# Altium schematic sheet O.schdoc
size 492 x 302 mm
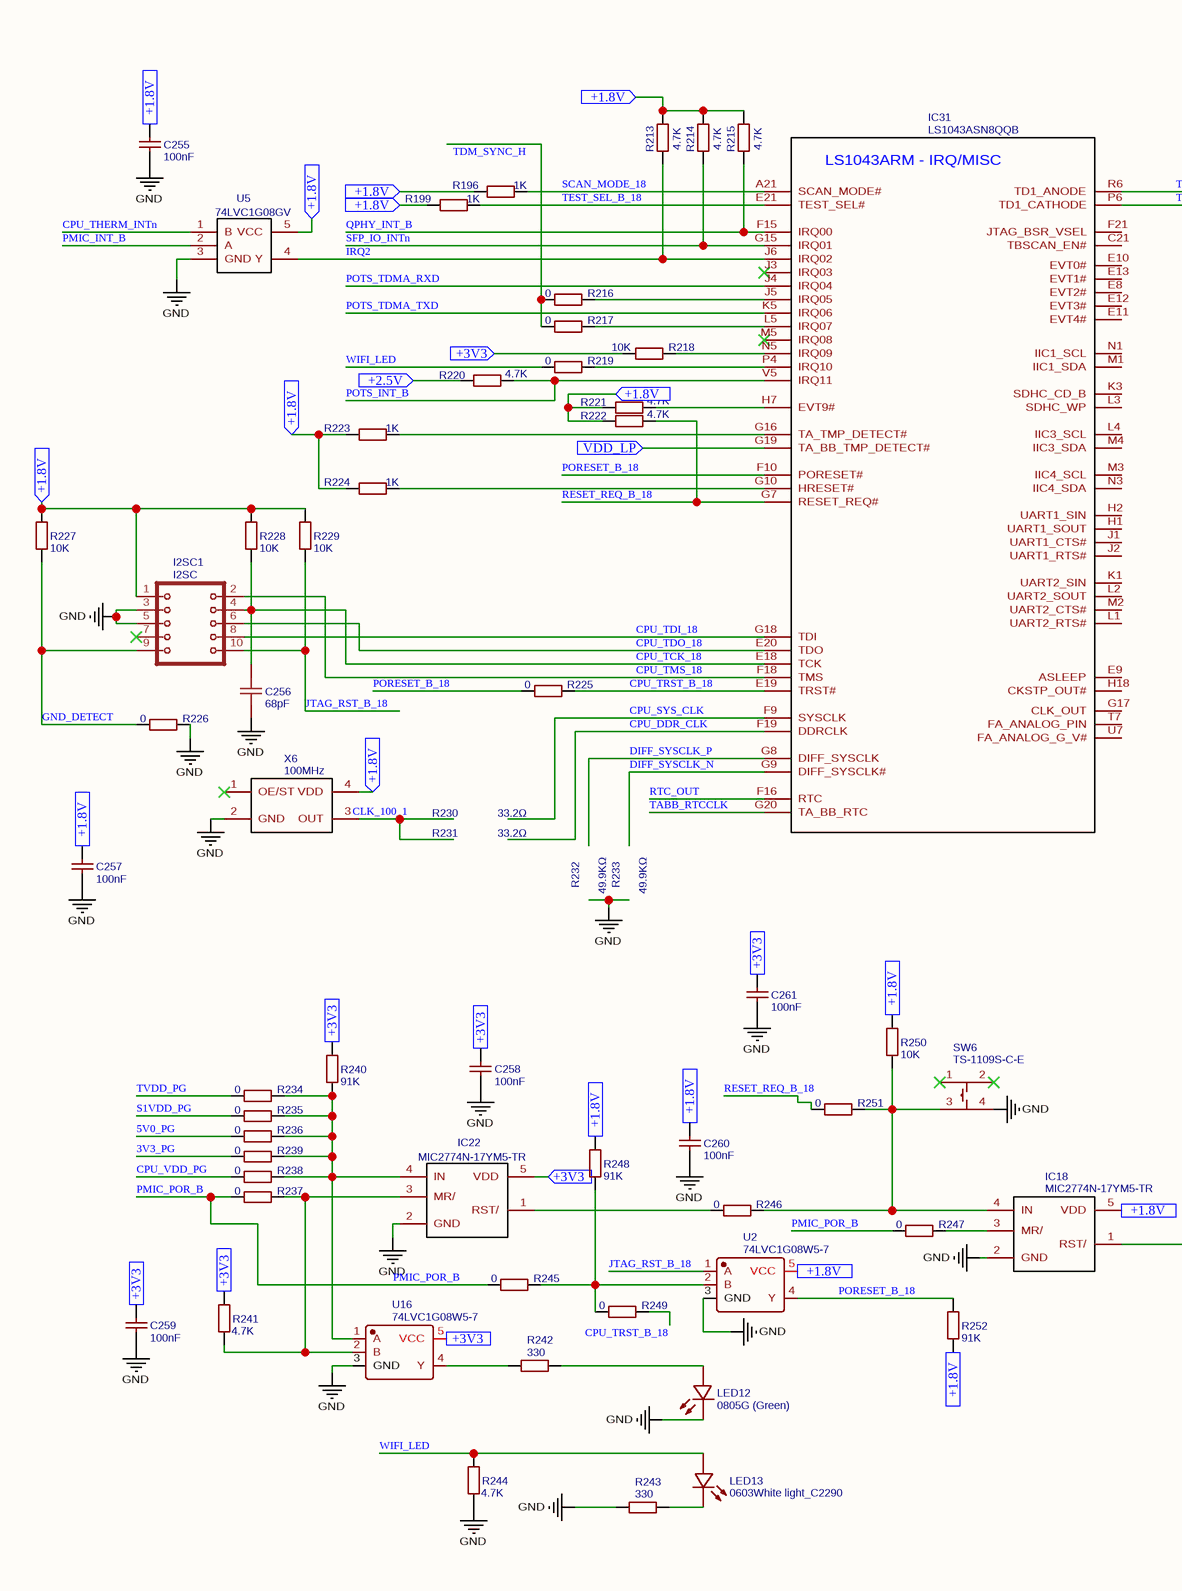
[diagram p0: O.schdoc, left]
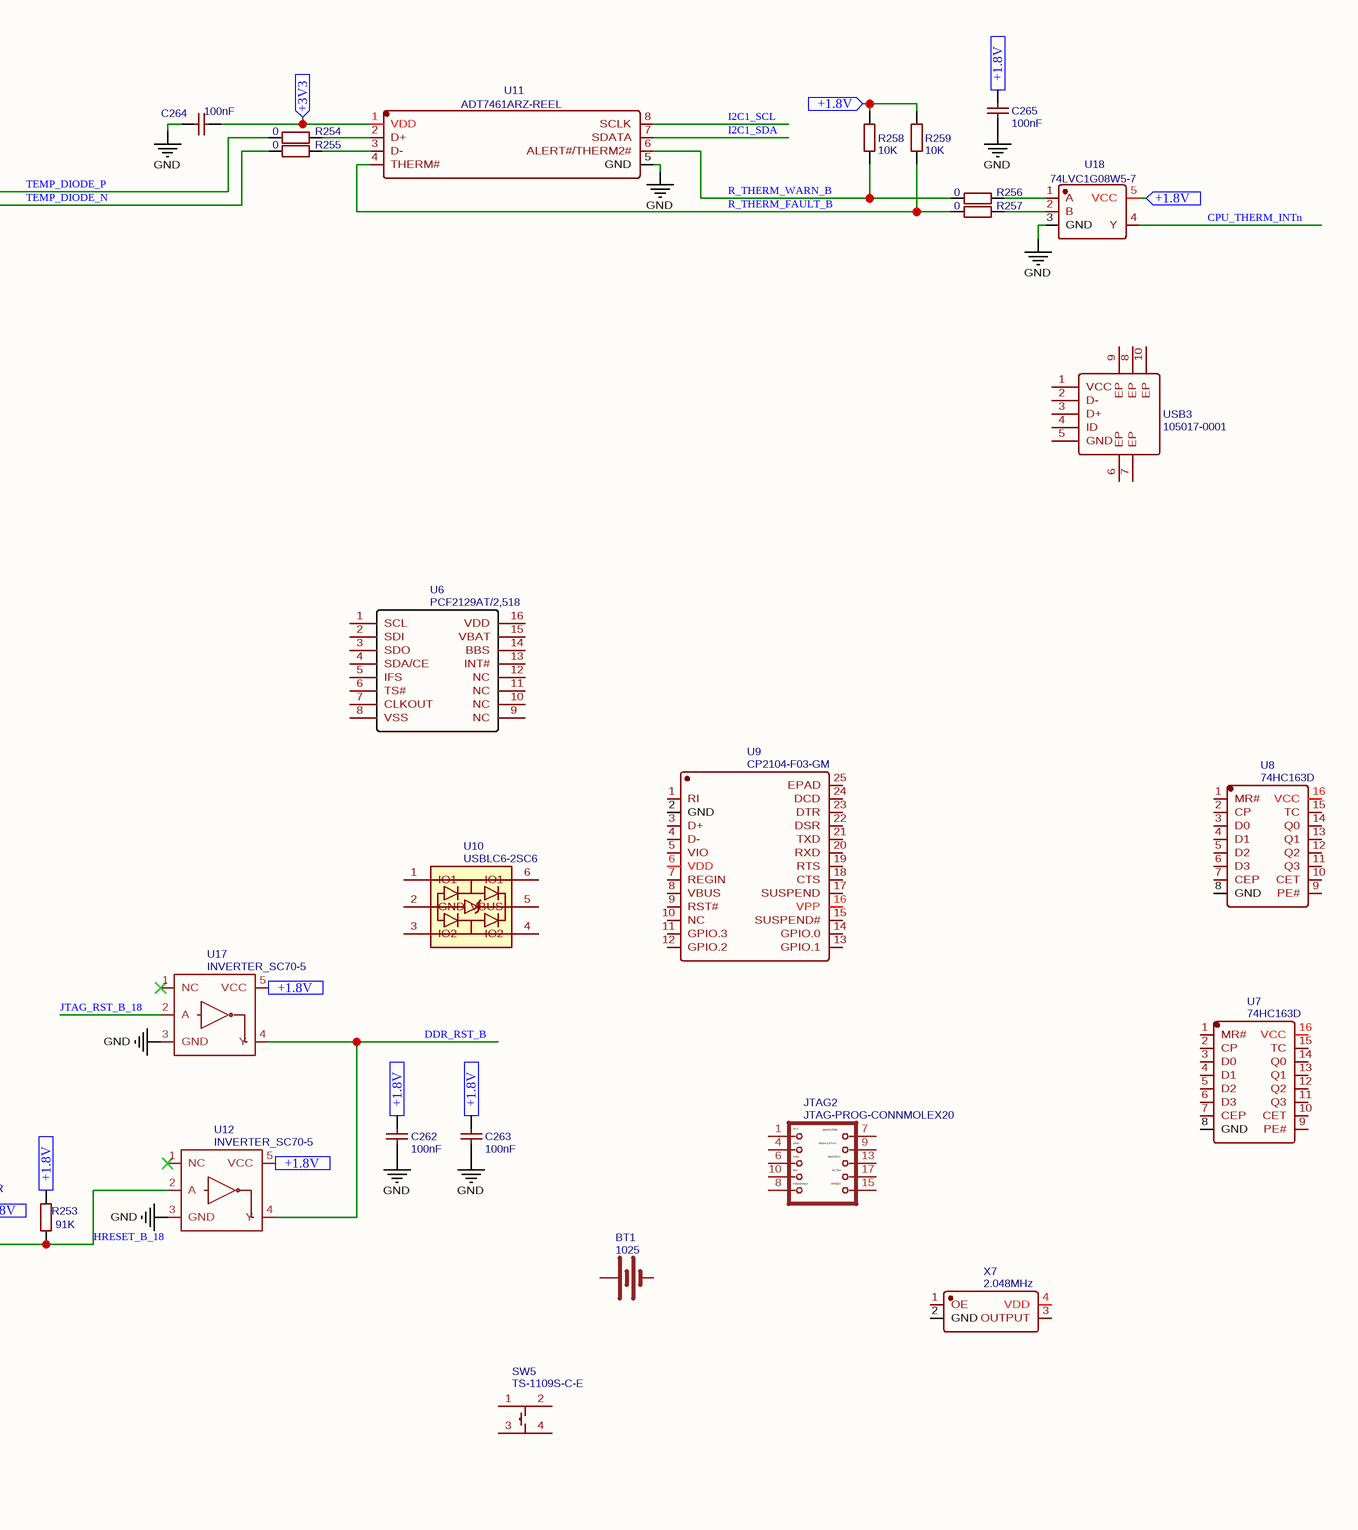
[diagram p1: O.schdoc, right]

## Parts
BT1  1025  [BAT-TH_KEYSTONE-1025]
C255  100nF  [C0402]
C256  68pF  [C0402]
C257  100nF  [C0402]
C258  100nF  [C0402]
C259  100nF  [C0402]
C260  100nF  [C0402]
C261  100nF  [C0402]
C262  100nF  [C0402]
C263  100nF  [C0402]
C264  100nF  [C0402]
C265  100nF  [C0402]
I2SC1  I2SC  [JTAG-10PIN-2.54MM-PTH]
IC18  MIC2774N-17YM5-TR  [SOT95P280X100-5N]
IC22  MIC2774N-17YM5-TR  [SOT95P280X100-5N]
IC31  LS1043ASN8QQB  [BGA621C65P25X25_1700X1700X218N]
JTAG2  JTAG-PROG-CONNMOLEX20  [JTAG-20PIN-2.54MM-PTH]
LED12  0805G (Green)  [LED0805-RD]
LED13  0603White light_C2290  [LED0603-R-RD]
R196  1K  [R0402]
R199  1K  [R0402]
R213  4.7K  [R0402]
R214  4.7K  [R0402]
R215  4.7K  [R0402]
R216  0  [R0402]
R217  0  [R0402]
R218  10K  [R0402]
R219  0  [R0402]
R220  4.7K  [R0402]
R221  4.7K  [R0402]
R222  4.7K  [R0402]
R223  1K  [R0402]
R224  1K  [R0402]
R225  0  [R0402]
R226  0  [R0402]
R227  10K  [R0402]
R228  10K  [R0402]
R229  10K  [R0402]
R230  33.2Ω  [0402]
R231  33.2Ω  [0402]
R232  49.9KΩ  [0402]
R233  49.9KΩ  [0402]
R234  0  [R0402]
R235  0  [R0402]
R236  0  [R0402]
R237  0  [R0402]
R238  0  [R0402]
R239  0  [R0402]
R240  91K  [R0402]
R241  4.7K  [R0402]
R242  330  [R0402]
R243  330  [R0402]
R244  4.7K  [R0402]
R245  0  [R0402]
R246  0  [R0402]
R247  0  [R0402]
R248  91K  [R0402]
R249  0  [R0402]
R250  10K  [R0402]
R251  0  [R0402]
R252  91K  [R0402]
R253  91K  [R0402]
R254  0  [R0402]
R255  0  [R0402]
R256  0  [R0402]
R257  0  [R0402]
R258  10K  [R0402]
R259  10K  [R0402]
SW5  TS-1109S-C-E  [SW-SMD_4P-L4.5-W4.5-P3.00-LS7.0]
SW6  TS-1109S-C-E  [SW-SMD_4P-L4.5-W4.5-P3.00-LS7.0]
U2  74LVC1G08W5-7  [SOT-25-5_L3.0-W1.8-P0.95-LS3.0-BL]
U5  74LVC1G08GV  [SOT-23-5_L3.0-W1.7-P0.95-LS2.8-BR]
U6  PCF2129AT/2,518  [SOIC-20_L13.0-W7.6-P1.27-LS10.6-BL]
U7  74HC163D  [SOIC-16_L9.9-W3.9-P1.27-LS6.0-BL]
U8  74HC163D  [SOIC-16_L9.9-W3.9-P1.27-LS6.0-BL]
U9  CP2104-F03-GM  [QFN-24_L4.0-W4.0-P0.50-BL-EP2.8]
U10  USBLC6-2SC6  [SOT-23-6]
U11  ADT7461ARZ-REEL  [SOIC-8_L4.9-W3.9-P1.27-LS6.0-BL]
U12  INVERTER_SC70-5  [SC70]
U16  74LVC1G08W5-7  [SOT-25-5_L3.0-W1.8-P0.95-LS3.0-BL]
U17  INVERTER_SC70-5  [SC70]
U18  74LVC1G08W5-7  [SOT-25-5_L3.0-W1.8-P0.95-LS3.0-BL]
USB3  105017-0001  [MICRO-USB-SMD_105017-0001]
X6  100MHz  [OSC-SMD_4P-L7.0-W5.0-BL]
X7  2.048MHz  [OSC-SMD_4P-L2.5-W2.0-BL]

## Ports
+1.8V (in), +2.5V (in), +3V3 (in), VDD_LP (in)

## Nets
GND: C255.1 C256.1 C257.1 C258.1 C259.1 C260.1 C261.1 C262.1 C263.1 C264.2 C265.1 I2SC1.3 I2SC1.5 IC18.2(GND) IC22.2(GND) LED12.1(K) R226.2 R243.1 R244.1 SW6.4 U2.3(GND) U5.3(GND) U11.5(GND) U12.3(GND) U16.3(GND) U17.3(GND) U18.3(GND) X6.2(GND)
3V3_PG: R239.1
5V0_PG: R236.1
+1.8V: C255.2 C257.2 C260.2 C262.2 C263.2 C265.2 I2SC1.1 IC18.5(VDD) R196.1 R199.1 R213.2 R214.2 R215.2 R221.1 R222.1 R223.1 R224.1 R227.2 R228.2 R229.2 R248.2 R250.2 R252.1 R253.2 R258.2 R259.2 U2.5(VCC) U5.5(VCC) U12.5(VCC) U17.5(VCC) U18.5(VCC) X6.4(VDD) ; port +1.8V
+2.5V: R220.2 ; port +2.5V
+3V3: C258.2 C259.2 C261.2 C264.1 IC22.5(VDD) R218.1 R240.2 R241.2 U11.1(VDD) U16.5(VCC) ; port +3V3
CPU_DDR_CLK: IC31.F19(DDRCLK)
CPU_SYS_CLK: IC31.F9(SYSCLK)
CPU_TCK_18: C256.2 I2SC1.4 IC31.E18(TCK) R228.1
CPU_TDI_18: I2SC1.8 IC31.G18(TDI)
CPU_TDO_18: I2SC1.6 IC31.E20(TDO)
CPU_THERM_INTn: U5.1(B) U18.4(Y)
CPU_TMS_18: I2SC1.2 IC31.F18(TMS)
CPU_TRST_B_18: IC31.E19(TRST#) R225.2 R249.2
CPU_VDD_PG: R238.1
DDR_RST_B: U12.4(Y) U17.4(Y)
DIFF_SYSCLK_N: IC31.G9(DIFF_SYSCLK#)
DIFF_SYSCLK_P: IC31.G8(DIFF_SYSCLK)
GND_DETECT: I2SC1.9 R226.1 R227.1
HRESET_B_18: IC18.1(RST/) R253.1 U12.2(A)
I2C1_SCL: U11.8(SCLK)
I2C1_SDA: U11.7(SDATA)
IRQ2: IC31.J6(IRQ02) R213.1 U5.4(Y)
JTAG_RST_B_18: I2SC1.10 R229.1 U2.1(A) U17.2(A)
PMIC_INT_B: U5.2(A)
PMIC_POR_B: R237.1 R245.1 R247.1
PORESET_B_18: IC31.F10(PORESET#) R225.1 R252.2 U2.4(Y)
POTS_INT_B: IC31.V5(IRQ11) R220.1
POTS_TDMA_RXD: IC31.J4(IRQ04)
POTS_TDMA_TXD: IC31.K5(IRQ06)
QPHY_INT_B: IC31.F15(IRQ00) R215.1
R_THERM_FAULT_B: R257.1 R259.1 U11.4(THERM#)
R_THERM_WARN_B: R256.1 R258.1 U11.6(ALERT#/THERM2#)
RESET_REQ_B_18: IC31.G7(RESET_REQ#) R222.2 R251.1
RTC_OUT: IC31.F16(RTC)
S1VDD_PG: R235.1
SCAN_MODE_18: IC31.A21(SCAN_MODE#) R196.2
SFP_IO_INTn: IC31.G15(IRQ01) R214.1
TABB_RTCCLK: IC31.G20(TA_BB_RTC)
TDM_SYNC_H: R216.1 R217.1
TEMP_DIODE_N: IC31.P6(TD1_CATHODE) R255.1
TEMP_DIODE_P: IC31.R6(TD1_ANODE) R254.1
TEST_SEL_B_18: IC31.E21(TEST_SEL#) R199.2
TVDD_PG: R234.1
VDD_LP: IC31.G19(TA_BB_TMP_DETECT#) ; port VDD_LP
WIFI_LED: LED13.1(A) R219.1 R244.2
NetIC18_3: IC18.3(MR/) R247.2
NetIC18_4: IC18.4(IN) R246.2 R250.1 R251.2 SW6.3
NetIC22_1: IC22.1(RST/) R246.1
NetIC22_3: IC22.3(MR/) R237.2 R241.1 U16.2(B)
NetIC22_4: IC22.4(IN) R234.2 R235.2 R236.2 R238.2 R239.2 R240.1 U16.1(A)
NetIC31_G10: IC31.G10(HRESET#) R224.2
NetIC31_G16: IC31.G16(TA_TMP_DETECT#) R223.2
NetIC31_H7: IC31.H7(EVT9#) R221.2
NetIC31_J5: IC31.J5(IRQ05) R216.2
NetIC31_L5: IC31.L5(IRQ07) R217.2
NetIC31_N5: IC31.N5(IRQ09) R218.2
NetIC31_P4: IC31.P4(IRQ10) R219.2
NetLED12_2: LED12.2(A) R242.2
NetLED13_2: LED13.2(K) R243.2
NetR242_1: R242.1 U16.4(Y)
NetR245_2: R245.2 R248.1 R249.1 U2.2(B)
NetR254_2: R254.2 U11.2(D+)
NetR255_2: R255.2 U11.3(D-)
NetR256_2: R256.2 U18.1(A)
NetR257_2: R257.2 U18.2(B)

Not connected (* = marked no-connect by the designer): BT1 1(+) 2(-); I2SC1 7*; IC31 C21(TBSCAN_EN#) E8(EVT2#) E9(ASLEEP) E10(EVT0#) E11(EVT4#) E12(EVT3#) E13(EVT1#) F21(JTAG_BSR_VSEL) G17(CLK_OUT) H1(UART1_SOUT) H2(UART1_SIN) H18(CKSTP_OUT#) J1(UART1_CTS#) J2(UART1_RTS#) J3(IRQ03)* K1(UART2_SIN) K3(SDHC_CD_B) L1(UART2_RTS#) L2(UART2_SOUT) L3(SDHC_WP) L4(IIC3_SCL) M1(IIC1_SDA) M2(UART2_CTS#) M3(IIC4_SCL) M4(IIC3_SDA) M5(IRQ08)* N1(IIC1_SCL) N3(IIC4_SDA) T7(FA_ANALOG_PIN) U7(FA_ANALOG_G_V#); JTAG2 1 4(3) 6(5) 7(2) 8(9) 9(4) 10(7) 13(6) 15(10) 17(8); SW5 1 2 3 4; SW6 1* 2*; U6 1(SCL) 2(SDI) 3(SDO) 4(SDA/CE) 5(IFS) 6(TS#) 7(CLKOUT) 8(VSS) 9(NC) 10(NC) 11(NC) 12(NC) 13(INT#) 14(BBS) 15(VBAT) 16(VDD); U7 1(MR#) 2(CP) 3(D0) 4(D1) 5(D2) 6(D3) 7(CEP) 8(GND) 9(PE#) 10(CET) 11(Q3) 12(Q2) 13(Q1) 14(Q0) 15(TC) 16(VCC); U8 1(MR#) 2(CP) 3(D0) 4(D1) 5(D2) 6(D3) 7(CEP) 8(GND) 9(PE#) 10(CET) 11(Q3) 12(Q2) 13(Q1) 14(Q0) 15(TC) 16(VCC); U9 1(RI) 2(GND) 3(D+) 4(D-) 5(VIO) 6(VDD) 7(REGIN) 8(VBUS) 9(RST#) 10(NC) 11(GPIO.3) 12(GPIO.2) 13(GPIO.1) 14(GPIO.0) 15(SUSPEND#) 16(VPP) 17(SUSPEND) 18(CTS) 19(RTS) 20(RXD) 21(TXD) 22(DSR) 23(DTR) 24(DCD) 25(EPAD); U10 1(IO1) 2(GND) 3(IO2) 4(IO2) 5(VBUS) 6(IO1); U12 1(NC)*; U17 1(NC)*; USB3 1(VCC) 2(D-) 3(D+) 4(ID) 5(GND) 6(EP) 7(EP) 8(EP) 9(EP) 10(EP); X6 1(OE/ST)* 3(OUT); X7 1(OE) 2(GND) 3(OUTPUT) 4(VDD)

## Notes on the sheet
- Labels drawn without touching a wire or pin: CLK_100_1
- (in symbol JTAG-PROG-CONNMOLEX20) VCC; SWDIOTMS; GND; SWDCLKTCK; SWOTDO; KEY; NCTDI; GNDDetect; nRESET
- (in symbol LS1043ASN8QQB) LS1043ARM - IRQ/MISC

## Library data of the parts
BT1 = 1025: BOM_Manufacturer: Keystone; Contributor: LCSC; BOM_Supplier: LCSC; BOM_Supplier Part: C238060; BOM_Manufacturer Part: 1025; spicePre: B; spiceSymbolName: 1025
C255 C257-C265 = 100nF: BOM_Manufacturer Part: CL05B104KO5NNNC; BOM_Manufacturer: SAMSUNG; nameAlias: Capacitance; SMT Type: Basic; BOM_Supplier: LCSC; BOM_LCSC Assembly: Yes; BOM_Supplier Part: C1525; spicePre: C; spiceSymbolName: CL05B104KO5NNNC
C256 = 68pF: BOM_Manufacturer: SAMSUNG; BOM_Manufacturer Part: CL05C680JB5NNNC; nameAlias: Capacitance; SMT Type: Basic; BOM_Supplier: LCSC; BOM_LCSC Assembly: Yes; BOM_Supplier Part: C14441; spicePre: C; spiceSymbolName: CL05C680JB5NNNC
IC18 IC22 = MIC2774N-17YM5-TR: Contributor: Ke'Ondrae_Mell; spicePre: I; spiceSymbolName: MIC2774N-17YM5-TR
IC31 = LS1043ASN8QQB: subpart_no: 1; Contributor: Ke'Ondrae_Mell; spicePre: I; spiceSymbolName: LS1043ASN8QQB
JTAG2 = JTAG-PROG-CONNMOLEX20: description: JTAG Program Connector; Contributor: PatternAgents; spicePre: J; spiceSymbolName: JTAG-PROG-CONNMOLEX20
LED12 = 0805G (Green): BOM_Manufacturer: KENTO; SMT Type: Basic; BOM_Supplier: LCSC; BOM_Manufacturer Part: 0805G (Green); BOM_LCSC Assembly: Yes; image: //image.lceda.cn/szlcsc/C2297.jpg; BOM_Supplier Part: C2297; spicePre: L; spiceSymbolName: 0805G (Green)
LED13 = 0603White light_C2290: BOM_Manufacturer: KENTO; SMT Type: Basic; BOM_Supplier: LCSC; BOM_Manufacturer Part: 0603White light; BOM_LCSC Assembly: Yes; image: //image.lceda.cn/szlcsc/C2290.jpg; BOM_Supplier Part: C2290; spicePre: L; spiceSymbolName: 0603White light_C2290
R196 R199 R223 R224 = 1K: BOM_Manufacturer: UniOhm; BOM_Manufacturer Part: 0402WGF1001TCE; nameAlias: Resistance (Ohms); SMT Type: Basic; BOM_Supplier: LCSC; BOM_LCSC Assembly: Yes; BOM_Supplier Part: C11702; spicePre: R; spiceSymbolName: 0402WGF1001TCE
R213-R215 R220-R222 R241 R244 = 4.7K: BOM_Manufacturer: UniOhm; BOM_Manufacturer Part: 0402WGF4701TCE; nameAlias: Resistance (Ohms); SMT Type: Basic; BOM_Supplier: LCSC; BOM_LCSC Assembly: Yes; BOM_Supplier Part: C25900; spicePre: R; spiceSymbolName: 0402WGF4701TCE
R216 R217 R219 R225 R226 R234-R239 R245-R247 R249 R251 R254-R257 = 0: BOM_Manufacturer: KOA; BOM_Manufacturer Part: RK73Z1ETTP; nameAlias: Resistance (Ohms); BOM_Supplier: LCSC; BOM_Supplier Part: C131359; spicePre: R; spiceSymbolName: RK73Z1ETTP
R218 R227-R229 R250 R258 R259 = 10K: BOM_Manufacturer: UniOhm; BOM_Manufacturer Part: 0402WGF1002TCE; nameAlias: Resistance (Ohms); SMT Type: Basic; BOM_Supplier: LCSC; BOM_LCSC Assembly: Yes; BOM_Supplier Part: C25744; spicePre: R; spiceSymbolName: 0402WGF1002TCE
R230 R231 = 33.2Ω: BOM_Manufacturer Part: RTT0233R2FTH; Value: 33.2Ω; BOM_Supplier Part: undefined; BOM_Supplier: LCSC; spicePre: R; spiceSymbolName: 33.2Ω
R232 R233 = 49.9KΩ: BOM_Manufacturer: FH; BOM_Manufacturer Part: RS-02K4992FT; nameAlias: Value; BOM_Supplier: LCSC; BOM_Supplier Part: C140148; spicePre: R; spiceSymbolName: RS-02K4992FT
R240 R248 R252 R253 = 91K: BOM_Manufacturer: UniOhm; BOM_Manufacturer Part: 0402WGF9102TCE; nameAlias: Resistance (Ohms); SMT Type: Extend; BOM_Supplier: LCSC; BOM_Supplier Part: C4147; BOM_LCSC Assembly: Yes; spicePre: R; spiceSymbolName: 0402WGF9102TCE
R242 R243 = 330: BOM_Manufacturer: UniOhm; BOM_Manufacturer Part: 0402WGF3300TCE; nameAlias: Resistance (Ohms); SMT Type: Basic; BOM_Supplier: LCSC; BOM_LCSC Assembly: Yes; BOM_Supplier Part: C25104; spicePre: R; spiceSymbolName: 0402WGF3300TCE
SW5 SW6 = TS-1109S-C-E: BOM_Manufacturer: XKB Enterprise; Contributor: LCSC; BOM_Supplier: LCSC; BOM_Supplier Part: C561507; BOM_Manufacturer Part: TS-1109S-C-E; spicePre: S; spiceSymbolName: TS-1109S-C-E
U2 U16 U18 = 74LVC1G08W5-7: BOM_Manufacturer: Diodes Incorporated; Contributor: LCSC; BOM_Supplier: LCSC; BOM_Supplier Part: C176929; BOM_Manufacturer Part: 74LVC1G08W5-7; spicePre: U; spiceSymbolName: 74LVC1G08W5-7
U5 = 74LVC1G08GV: BOM_Manufacturer: PHILIPS; SMT Type: Extend; BOM_Supplier: LCSC; BOM_Manufacturer Part: 74LVC1G08GV; image: //image.lceda.cn/szlcsc/C6075.jpg; BOM_Supplier Part: C6075; BOM_LCSC Assembly: Yes; spicePre: U; spiceSymbolName: 74LVC1G08GV
U6 = PCF2129AT/2,518: BOM_Manufacturer: NXP; SMT Type: Extend; BOM_Supplier: LCSC; BOM_Manufacturer Part: PCF2129AT/2,518; image: //image.lceda.cn/szlcsc/C47508.jpg; BOM_Supplier Part: C47508; BOM_LCSC Assembly: Yes; spicePre: U; spiceSymbolName: PCF2129AT/2,518
U7 U8 = 74HC163D: BOM_Manufacturer: PHILIPS; spicePre: X; BOM_Supplier: LCSC; BOM_Manufacturer Part: 74HC163D; image: //image.lceda.cn/szlcsc/C5611.jpg; BOM_Supplier Part: C5611; spiceSymbolName: 74HC163D
U9 = CP2104-F03-GM: BOM_Manufacturer: SILICON LABS; SMT Type: Basic; BOM_Supplier: LCSC; BOM_Manufacturer Part: CP2104-F03-GM; image: //image.lceda.cn/szlcsc/C47742.jpg; BOM_Supplier Part: C47742; BOM_LCSC Assembly: Yes; spicePre: U; spiceSymbolName: CP2104-F03-GM
U10 = USBLC6-2SC6: Contributor: KiCAD; license: https://www.gnu.org/licenses/lgpl-2.1.html; spicePre: U; spiceSymbolName: USBLC6-2SC6
U11 = ADT7461ARZ-REEL: BOM_Manufacturer: ON Semicon; Contributor: LCSC; SMT Type: Extend; BOM_Supplier: LCSC; BOM_Supplier Part: C184567; BOM_Manufacturer Part: ADT7461ARZ-REEL; BOM_LCSC Assembly: Yes; spicePre: U; spiceSymbolName: ADT7461ARZ-REEL
U12 U17 = INVERTER_SC70-5: description: Single inverter, SOT23-5; Contributor: SparkFun; spicePre: U; spiceSymbolName: INVERTER_SC70-5
USB3 = 105017-0001: BOM_Manufacturer: MOLEX; Contributor: LCSC; BOM_Supplier: LCSC; BOM_Manufacturer Part: 105017-0001; BOM_Supplier Part: C136000; spicePre: U; spiceSymbolName: 105017-0001
X6 = 100MHz: BOM_Manufacturer Part: SIT8008AI-82-33E-100.000000Y; BOM_Manufacturer: SITIME; nameAlias: Frequency; SMT Type: Extend; BOM_Supplier: LCSC; BOM_Supplier Part: C9248; BOM_LCSC Assembly: Yes; spicePre: X; spiceSymbolName: SIT8008AI-82-33E-100.000000Y
X7 = 2.048MHz: BOM_Manufacturer: Seiko Epson; BOM_Manufacturer Part: SG-8018CG-2.048000MHz-TJHPA; nameAlias: Frequency; Contributor: LCSC; BOM_Supplier: LCSC; BOM_Supplier Part: C390531; spicePre: X; spiceSymbolName: SG-8018CG-2.048000MHZ-TJHPA
I2SC1 = I2SC: spicePre: I; spiceSymbolName: I2SC